# Altium schematic sheet Input.SchDoc: Myon Deco - Input Stage
size A; DrawnBy: Matias Lopez; Revision: Prototype; SheetNumber: 2; SheetTotal: 7
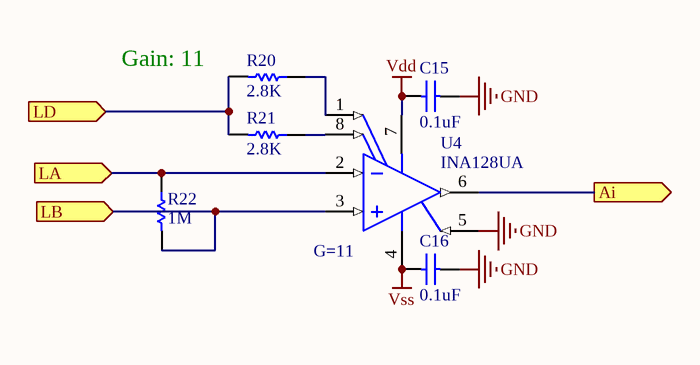
[diagram p0: Input.SchDoc]

## Parts
C15  value 0.1uF  [C0805]  (hidden comment: Cap)
C16  value 0.1uF  [C0805]  (hidden comment: Cap)
R20  value 2.8K  [C1206]  (hidden comment: Res1)
R21  value 2.8K  [C1206]  (hidden comment: Res1)
R22  value 1M  [C1206]  (hidden comment: Res1)
U4  INA128UA  [TI-D8_N]

## Ports
Ai (out), LA (in), LB (in), LD (in)

## Nets
GND: C15.1 C16.1 U4.5(REF)
Vdd: C15.2 U4.7(V+)
Vss: C16.2 U4.4(V-)
Ai: U4.6(VO) ; port Ai
LA: R22.1 U4.2(VIN-) ; port LA
LB: R22.2 U4.3(VIN+) ; port LB
LD: R20.2 R21.2 ; port LD
NetR20_1: R20.1 U4.1(RG)
NetR21_1: R21.1 U4.8(RG)

## Notes on the sheet
- (near R20) Gain: 11
- (near U4) G=11

## Library data of the parts
C15 C16 = Cap: Capacitor; Published: 8-Jun-2000; LatestRevisionDate: 17-Jul-2002; LatestRevisionNote: Re-released for DXP Platform.; PackageReference: RAD-0.3; Publisher: Altium Limited; PackageDescription: Radial Cap, Thru-Hole; 2 Leads; 0.3 in Pin Spacing
R20-R22 = Res1: Resistor; Published: 8-Jun-2000; LatestRevisionDate: 17-Jul-2002; LatestRevisionNote: Re-released for DXP Platform.; PackageReference: AXIAL-0.3; Publisher: Altium Limited; PackageDescription: Axial Device, Thru-Hole; 2 Leads; 0.3 in Pin Spacing
U4 = INA128UA: Precision, Low Power Instrumentation Amplifier, -40 to 85 degC, 8-pin SOIC (D8), Green (RoHS & no Sb/Br); Manufacturer: Texas Instruments; CMRR(Min)(dB): 110; Gain(V/V): 1 to 10000; Input Bias Current (+/-)(Max)(nA): 10; Input Offset (+/-)(Max)(uV): 125; Input Offset Drift (+/-)(Max)(uV/Degrees Celsius): 1; Noise at 1kHz(Typ)(nV/rt(Hz)): 8; Non-Linearity (+/-)(Max)(%): 0.004; Quiescent Current (+/-)(Typ)(mA): 0.7; SubFamily: Dual Supply; Vs(Max)(V): 36; Vs(Min)(V): 4.5; DatasheetVersion: SBOS051B; PackageVersion: 4040047-3/M, 06/2011; PackageReference: D8; PackageDescription: 8-Pin Plastic Small Outline, Body 4.9 x 3.9 mm, Pitch 1.27 mm; Supplier 1: Digi-Key; Supplier Part Number 1: INA128UA-ND; Supplier 2: Newark; Supplier Part Number 2: 35C1730; Supplier 3: Mouser; Supplier Part Number 3: 595-INA128UA; Eco-Plan: Green (RoHS & no Sb/Br); Number of Channels: 1; Mounting Technology: Surface Mount; Code_JEDEC: MS-012; PartNumber: INA128UA; ComponentLink1Description: Manufacturer URL; ComponentLink1URL: http://www.ti.com/; ComponentLink2Description: Datasheet; ComponentLink2URL: http://www.ti.com/general/docs/lit/getliterature.tsp?genericPartNumber=INA128&fileType=pdf; ComponentLink3Description: Package Specification; ComponentLink3URL: http://www.ti.com/litv/pdf/msoi002j